# Altium schematic sheet Sheet_1_2020-08-21_13-21-40.schdoc
size 293 x 186 mm
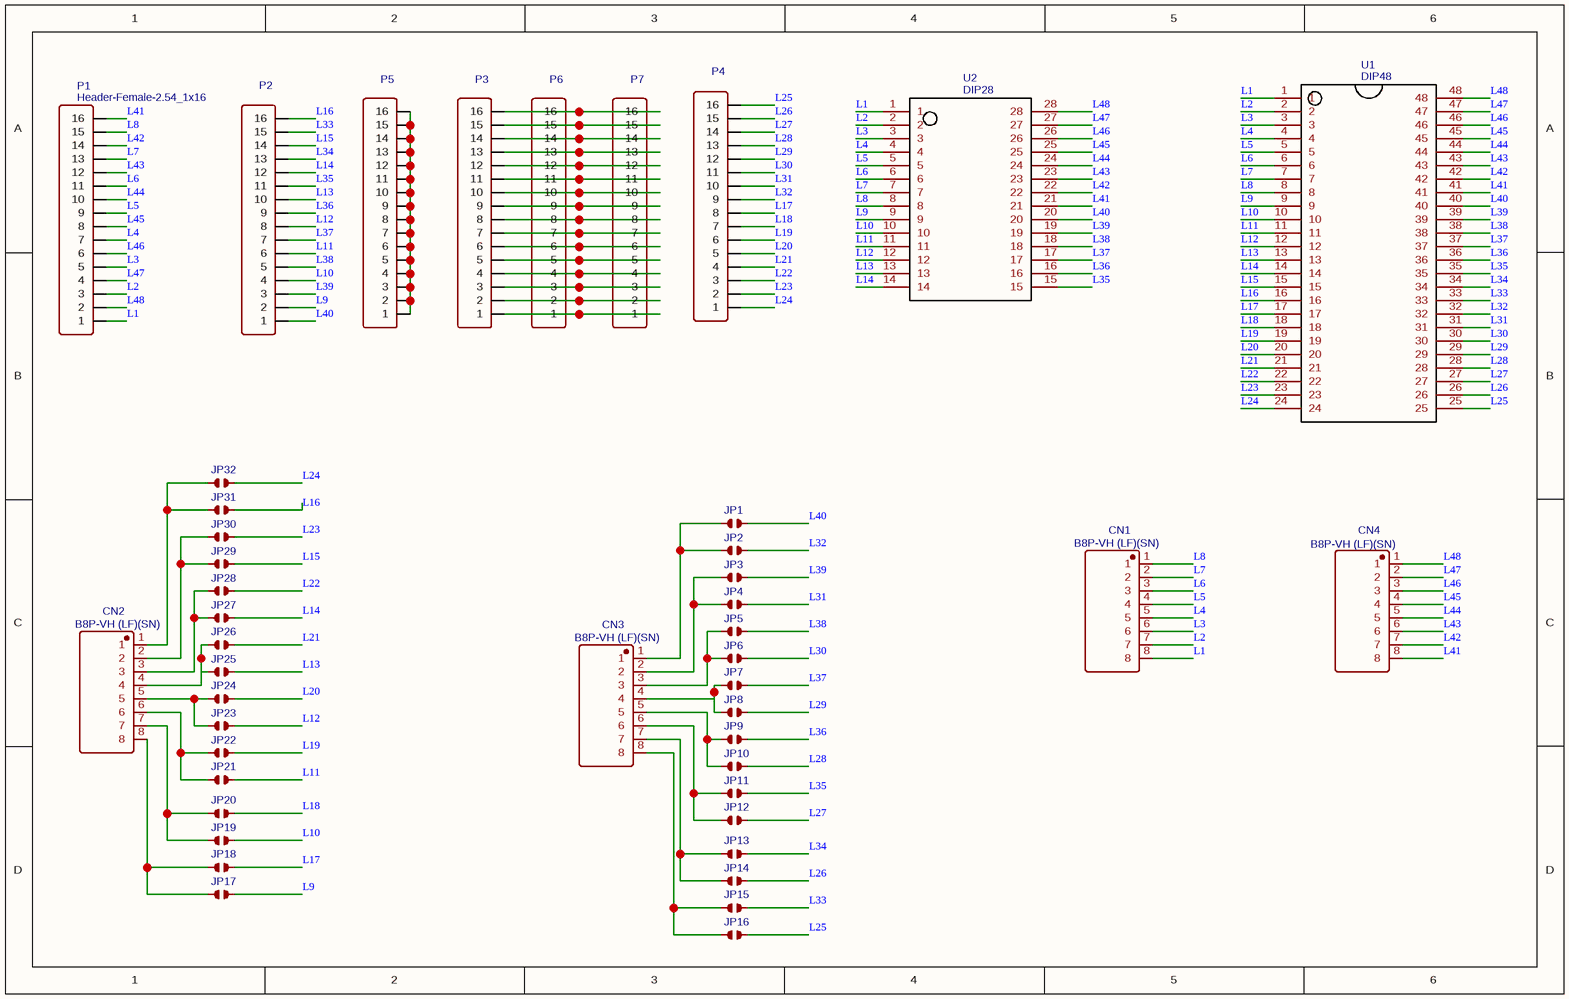
[diagram p0: Sheet_1_2020-08-21_13-21-40.schdoc]

## Parts
CN1  B8P-VH (LF)(SN)  [CONN-TH_B8P-VH (LF)(SN)]
CN2  B8P-VH (LF)(SN)  [CONN-TH_B8P-VH (LF)(SN)]
CN3  B8P-VH (LF)(SN)  [CONN-TH_B8P-VH (LF)(SN)]
CN4  B8P-VH (LF)(SN)  [CONN-TH_B8P-VH (LF)(SN)]
JP1  Jumper pad  [JUMPERPADS]  (value not drawn)
JP2  Jumper pad  [JUMPERPADS]  (value not drawn)
JP3  Jumper pad  [JUMPERPADS]  (value not drawn)
JP4  Jumper pad  [JUMPERPADS]  (value not drawn)
JP5  Jumper pad  [JUMPERPADS]  (value not drawn)
JP6  Jumper pad  [JUMPERPADS]  (value not drawn)
JP7  Jumper pad  [JUMPERPADS]  (value not drawn)
JP8  Jumper pad  [JUMPERPADS]  (value not drawn)
JP9  Jumper pad  [JUMPERPADS]  (value not drawn)
JP10  Jumper pad  [JUMPERPADS]  (value not drawn)
JP11  Jumper pad  [JUMPERPADS]  (value not drawn)
JP12  Jumper pad  [JUMPERPADS]  (value not drawn)
JP13  Jumper pad  [JUMPERPADS]  (value not drawn)
JP14  Jumper pad  [JUMPERPADS]  (value not drawn)
JP15  Jumper pad  [JUMPERPADS]  (value not drawn)
JP16  Jumper pad  [JUMPERPADS]  (value not drawn)
JP17  Jumper pad  [JUMPERPADS]  (value not drawn)
JP18  Jumper pad  [JUMPERPADS]  (value not drawn)
JP19  Jumper pad  [JUMPERPADS]  (value not drawn)
JP20  Jumper pad  [JUMPERPADS]  (value not drawn)
JP21  Jumper pad  [JUMPERPADS]  (value not drawn)
JP22  Jumper pad  [JUMPERPADS]  (value not drawn)
JP23  Jumper pad  [JUMPERPADS]  (value not drawn)
JP24  Jumper pad  [JUMPERPADS]  (value not drawn)
JP25  Jumper pad  [JUMPERPADS]  (value not drawn)
JP26  Jumper pad  [JUMPERPADS]  (value not drawn)
JP27  Jumper pad  [JUMPERPADS]  (value not drawn)
JP28  Jumper pad  [JUMPERPADS]  (value not drawn)
JP29  Jumper pad  [JUMPERPADS]  (value not drawn)
JP30  Jumper pad  [JUMPERPADS]  (value not drawn)
JP31  Jumper pad  [JUMPERPADS]  (value not drawn)
JP32  Jumper pad  [JUMPERPADS]  (value not drawn)
P1  Header-Female-2.54_1x16  [HDR-TH_16P-P2.54-V]
P2  Header-Female-2.54_1x16  [HDR-TH_16P-P2.54-V]  (value not drawn)
P3  Header-Female-2.54_1x16  [HDR-TH_16P-P2.54-V]  (value not drawn)
P4  Header-Female-2.54_1x16  [HDR-TH_16P-P2.54-V]  (value not drawn)
P5  Header-Female-2.54_1x16  [HDR-TH_16P-P2.54-V]  (value not drawn)
P6  Header-Female-2.54_1x16  [HDR-TH_16P-P2.54-V]  (value not drawn)
P7  Header-Female-2.54_1x16  [HDR-TH_16P-P2.54-V]  (value not drawn)
U1  DIP48  [DIP48]
U2  DIP28  [DIP-28_300MIL]

## Nets
L1: CN1.8 P1.1 U1.1 U2.1
L2: CN1.7 P1.3 U1.2 U2.2
L3: CN1.6 P1.5 U1.3 U2.3
L4: CN1.5 P1.7 U1.4 U2.4
L5: CN1.4 P1.9 U1.5 U2.5
L6: CN1.3 P1.11 U1.6 U2.6
L7: CN1.2 P1.13 U1.7 U2.7
L8: CN1.1 P1.15 U1.8 U2.8
L9: JP17.2 P2.2 U1.9 U2.9
L10: JP19.2 P2.4 U1.10 U2.10
L11: JP21.2 P2.6 U1.11 U2.11
L12: JP23.2 P2.8 U1.12 U2.12
L13: JP25.2 P2.10 U1.13 U2.13
L14: JP27.1 P2.12 U1.14 U2.14
L15: JP29.1 P2.14 U1.15
L16: JP31.1 P2.16 U1.16
L17: JP18.2 P4.8 U1.17
L18: JP20.2 P4.7 U1.18
L19: JP22.2 P4.6 U1.19
L20: JP24.2 P4.5 U1.20
L21: JP26.2 P4.4 U1.21
L22: JP28.1 P4.3 U1.22
L23: JP30.1 P4.2 U1.23
L24: JP32.1 P4.1 U1.24
L25: JP16.2 P4.16 U1.25
L26: JP14.2 P4.15 U1.26
L27: JP12.2 P4.14 U1.27
L28: JP10.2 P4.13 U1.28
L29: JP8.2 P4.12 U1.29
L30: JP6.1 P4.11 U1.30
L31: JP4.1 P4.10 U1.31
L32: JP2.1 P4.9 U1.32
L33: JP15.2 P2.15 U1.33
L34: JP13.2 P2.13 U1.34
L35: JP11.2 P2.11 U1.35 U2.15
L36: JP9.2 P2.9 U1.36 U2.16
L37: JP7.2 P2.7 U1.37 U2.17
L38: JP5.1 P2.5 U1.38 U2.18
L39: JP3.1 P2.3 U1.39 U2.19
L40: JP1.1 P2.1 U1.40 U2.20
L41: CN4.8 P1.16 U1.41 U2.21
L42: CN4.7 P1.14 U1.42 U2.22
L43: CN4.6 P1.12 U1.43 U2.23
L44: CN4.5 P1.10 U1.44 U2.24
L45: CN4.4 P1.8 U1.45 U2.25
L46: CN4.3 P1.6 U1.46 U2.26
L47: CN4.2 P1.4 U1.47 U2.27
L48: CN4.1 P1.2 U1.48 U2.28
NetCN2_1: CN2.1 JP31.2 JP32.2
NetCN2_2: CN2.2 JP29.2 JP30.2
NetCN2_3: CN2.3 JP27.2 JP28.2
NetCN2_4: CN2.4 JP25.1 JP26.1
NetCN2_5: CN2.5 JP23.1 JP24.1
NetCN2_6: CN2.6 JP21.1 JP22.1
NetCN2_7: CN2.7 JP19.1 JP20.1
NetCN2_8: CN2.8 JP17.1 JP18.1
NetCN3_1: CN3.1 JP1.2 JP2.2
NetCN3_2: CN3.2 JP3.2 JP4.2
NetCN3_3: CN3.3 JP5.2 JP6.2
NetCN3_4: CN3.4 JP7.1 JP8.1
NetCN3_5: CN3.5 JP9.1 JP10.1
NetCN3_6: CN3.6 JP11.1 JP12.1
NetCN3_7: CN3.7 JP13.1 JP14.1
NetCN3_8: CN3.8 JP15.1 JP16.1
NetP3_1: P3.1 P6.1 P7.1
NetP3_2: P3.2 P6.2 P7.2
NetP3_3: P3.3 P6.3 P7.3
NetP3_4: P3.4 P6.4 P7.4
NetP3_5: P3.5 P6.5 P7.5
NetP3_6: P3.6 P6.6 P7.6
NetP3_7: P3.7 P6.7 P7.7
NetP3_8: P3.8 P6.8 P7.8
NetP3_9: P3.9 P6.9 P7.9
NetP3_10: P3.10 P6.10 P7.10
NetP3_11: P3.11 P6.11 P7.11
NetP3_12: P3.12 P6.12 P7.12
NetP3_13: P3.13 P6.13 P7.13
NetP3_14: P3.14 P6.14 P7.14
NetP3_15: P3.15 P6.15 P7.15
NetP3_16: P3.16 P6.16 P7.16
NetP5_1: P5.1 P5.2 P5.3 P5.4 P5.5 P5.6 P5.7 P5.8 P5.9 P5.10 P5.11 P5.12 P5.13 P5.14 P5.15 P5.16

## Library data of the parts
CN1-CN4 = B8P-VH (LF)(SN): BOM_Manufacturer: JST Sales America; Contributor: LCSC; BOM_Supplier: LCSC; BOM_Supplier Part: C160320; BOM_Manufacturer Part: -; spicePre: C; spiceSymbolName: B8P-VH (LF)(SN)
JP1-JP32 = Jumper pad: Contributor: NominalAnimal; spicePre: J; spiceSymbolName: Jumper pad
P1-P7 = Header-Female-2.54_1x16: BOM_Manufacturer: BOOMELE; BOM_Manufacturer Part: Female header1*16P pitch 2.54mm; BOM_Supplier: LCSC; image: //image.lceda.cn/szlcsc/C66987.jpg; BOM_Supplier Part: C66987; spicePre: P; spiceSymbolName: Header-Female-2.54_1x16
U1 = DIP48: Contributor: Xevious; spicePre: U; spiceSymbolName: DIP48
U2 = DIP28: BOM_Manufacturer Part: New SchematicLib; Contributor: FYP_Squad; spicePre: U; spiceSymbolName: DIP28